# EAGLE design schematic (EAGLE 8.0.2)
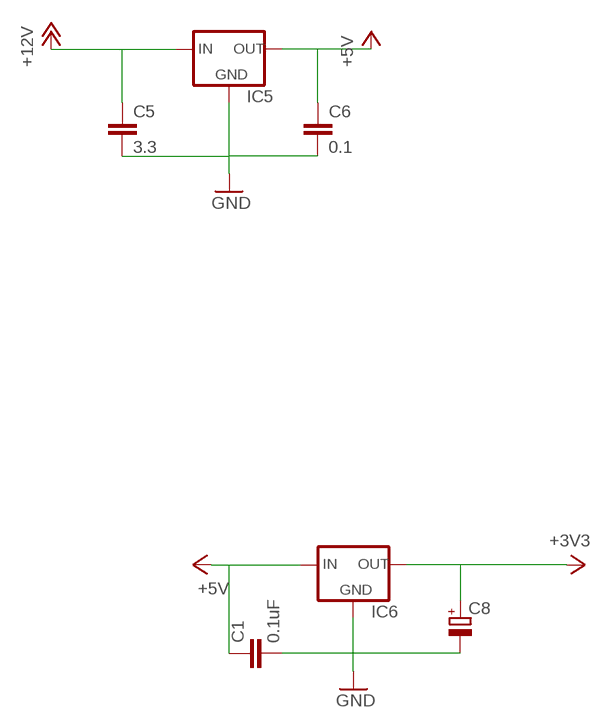
[diagram p0: schematic, sheet 1, part 1 of 2]
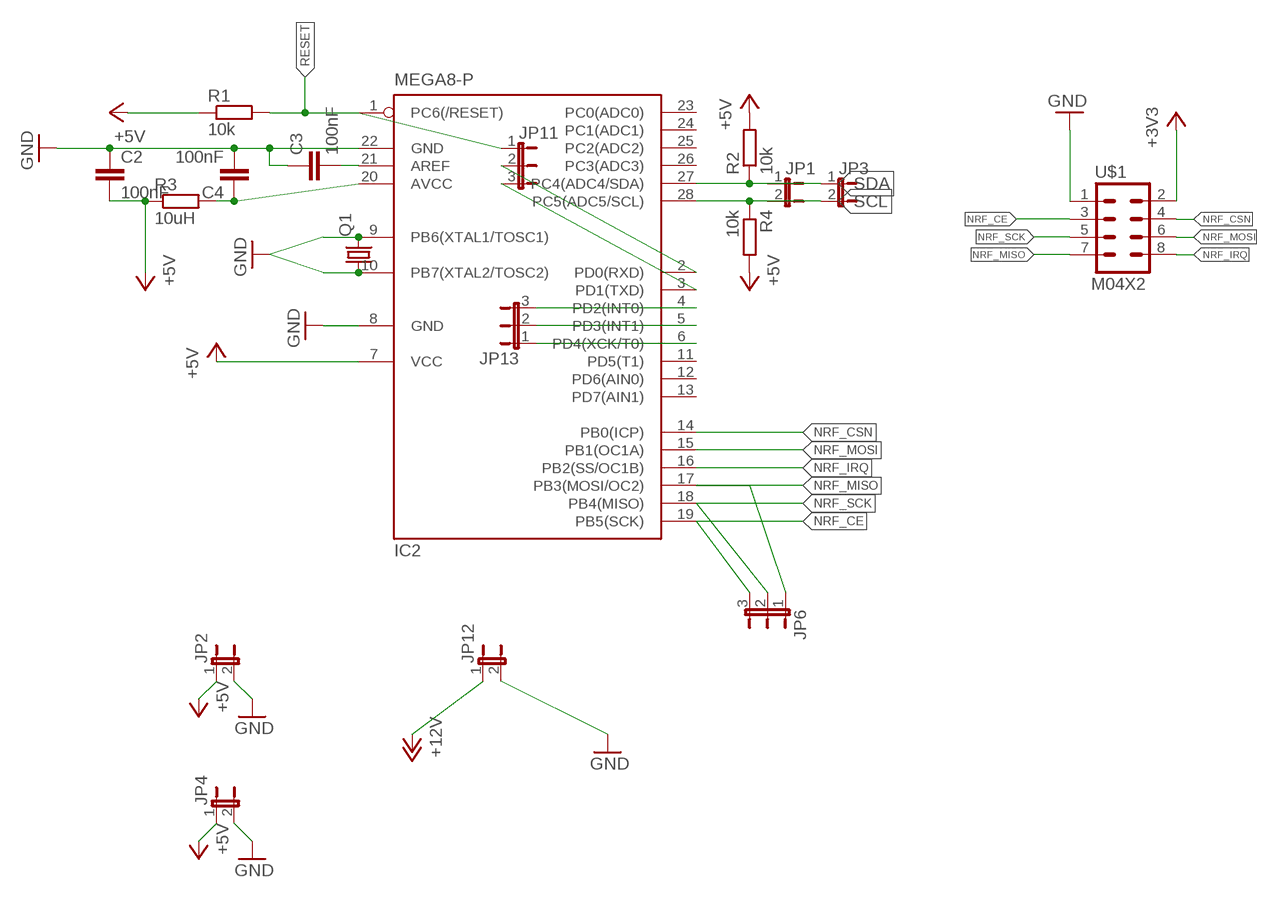
[diagram p1: schematic, sheet 1, part 2 of 2]

## Parts
C1  0.1uF  C2.5/2  [C2.5-2]
C2  100nF  C2.5/2  [C2.5-2]
C3  100nF  C2.5/4  [C2.5-4]
C4  100nF  C5/2.5  [C5B2.5]
C5  3.3  C-EU025-024X044  [C025-024X044]
C6  0.1  C-EU025-024X044  [C025-024X044]
C8  CPOL-EUE2.5-6  [E2,5-6]
IC2  MEGA8-P  [DIL28-3]
IC5  78XXL  [78XXL]
IC6  78XXL  [78XXL]
JP1  JP1E  [JP1]
JP2  JP1E  [JP1]
JP3  JP1E  [JP1]
JP4  JP1E  [JP1]
JP6  JP2E  [JP2]
JP11  JP2E  [JP2]
JP12  JP1E  [JP1]
JP13  JP2E  [JP2]
Q1  CRYSTALHC49S  [HC49/S]
R1  10k  R-EU_0204/5  [0204/5]
R2  10k  R-EU_0204/5  [0204/5]
R3  10uH  R-EU_0309/10  [0309/10]
R4  10k  R-EU_0204/5  [0204/5]
U$1  M04X2  [2X4]

## Nets
+3V3: C8.+ IC6.OUT U$1.2
+5V: C1.1 C2.2 C6.1 IC2.7(VCC) IC5.OUT IC6.IN JP2.1 JP4.1 R1.1 R2.2 R3.1 R4.2
+12V: C5.1 IC5.IN JP12.1
GND: C1.2 C2.1 C3.1 C4.2 C5.2 C6.2 C8.- IC2.8(GND) IC2.22(GND) IC5.GND IC6.GND JP2.2 JP4.2 JP12.2 U$1.1
N$2: C3.2 IC2.21(AREF)
N$5: IC2.9(PB6(XTAL1/TOSC1)) Q1.2
N$6: IC2.10(PB7(XTAL2/TOSC2)) Q1.1
N$9: C4.1 IC2.20(AVCC) R3.2
N$39: IC2.2(PD0(RXD)) JP11.2
N$40: IC2.3(PD1(TXD)) JP11.3
N$41: IC2.4(PD2(INT0)) JP13.3
N$42: IC2.5(PD3(INT1)) JP13.2
N$43: IC2.6(PD4(XCK/T0)) JP13.1
NRF_CE: IC2.19(PB5(SCK)) JP6.3 U$1.3
NRF_CSN: IC2.14(PB0(ICP)) U$1.4
NRF_IRQ: IC2.16(PB2(SS/OC1B)) U$1.8
NRF_MISO: IC2.17(PB3(MOSI/OC2)) JP6.1 U$1.7
NRF_MOSI: IC2.15(PB1(OC1A)) U$1.6
NRF_SCK: IC2.18(PB4(MISO)) JP6.2 U$1.5
RESET: IC2.1(PC6(/RESET)) JP11.1 R1.2
SCL: IC2.28(PC5(ADC5/SCL)) JP1.2 JP3.2 R4.1
SDA: IC2.27(PC4(ADC4/SDA)) JP1.1 JP3.1 R2.1
Unconnected: IC2.11(PD5(T1)) IC2.12(PD6(AIN0)) IC2.13(PD7(AIN1)) IC2.23(PC0(ADC0)) IC2.24(PC1(ADC1)) IC2.25(PC2(ADC2)) IC2.26(PC3(ADC3))

## Library data of the parts
C1-C4 = capacitor-wima:C: CAPACITOR naming: grid - package width
C5 C6 = rcl:C-EU: CAPACITOR, European symbol
C8 = resistor:CPOL-EU: POLARIZED CAPACITOR, European symbol
IC2 = atmel:MEGA8-P: MICROCONTROLLER 8 Kbytes FLASH, 1 kbytes SRAM, 512 bytes EEPROM, USART, 4-channel 10 bit ADC, 2-channel 8 bit ADC Pin compatible with Atmega48, ATMega88, ATMega168 Source: avr.lbr; OC_FARNELL: unknown; OC_NEWARK: unknown
IC5 IC6 = v-reg:78XXL: VOLTAGE REGULATOR
JP1-JP4 JP12 = jumper:JP1E: JUMPER
JP6 JP11 JP13 = jumper:JP2E: JUMPER
Q1 = crystal:CRYSTAL: CRYSTAL; OC_FARNELL: 1667008; OC_NEWARK: unknown
R1-R4 = resistor:R-EU_: RESISTOR, European symbol
U$1 = SparkFun:M04X2

## Net classes
0 default: clearance 0.205 mm

## Board
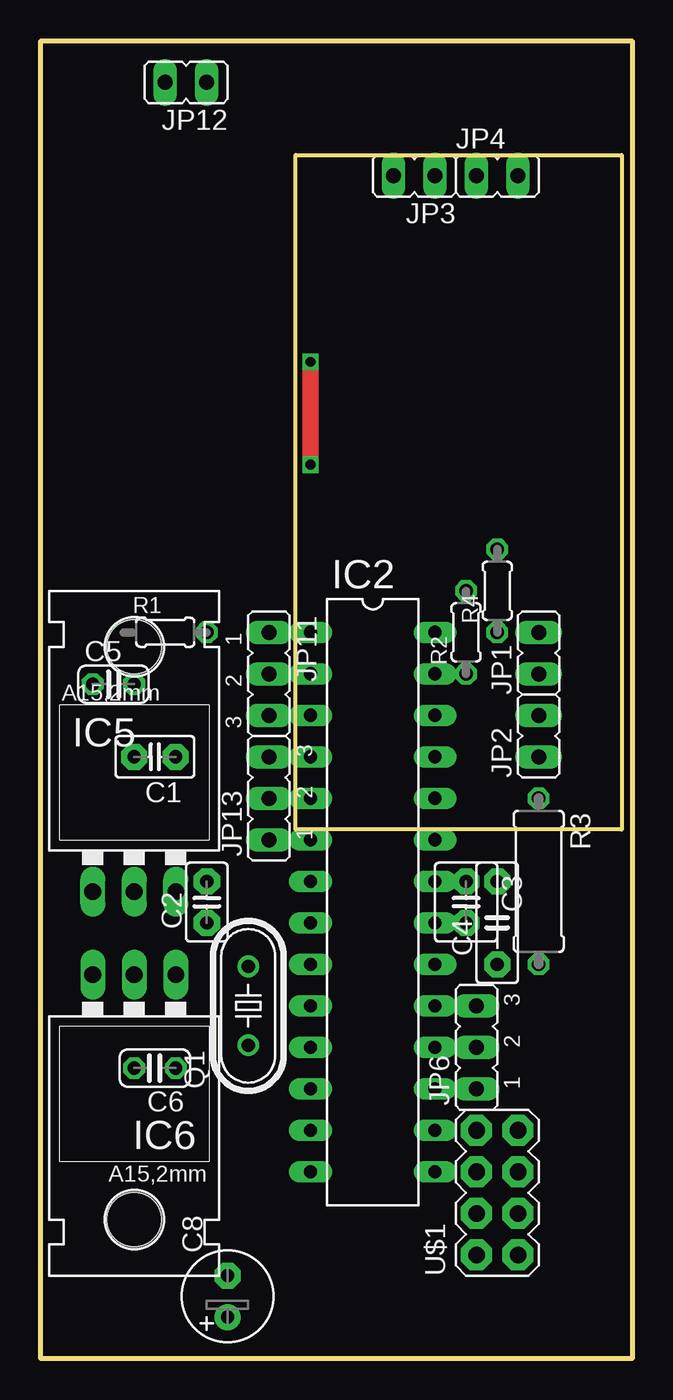
[diagram p2: board, top side]
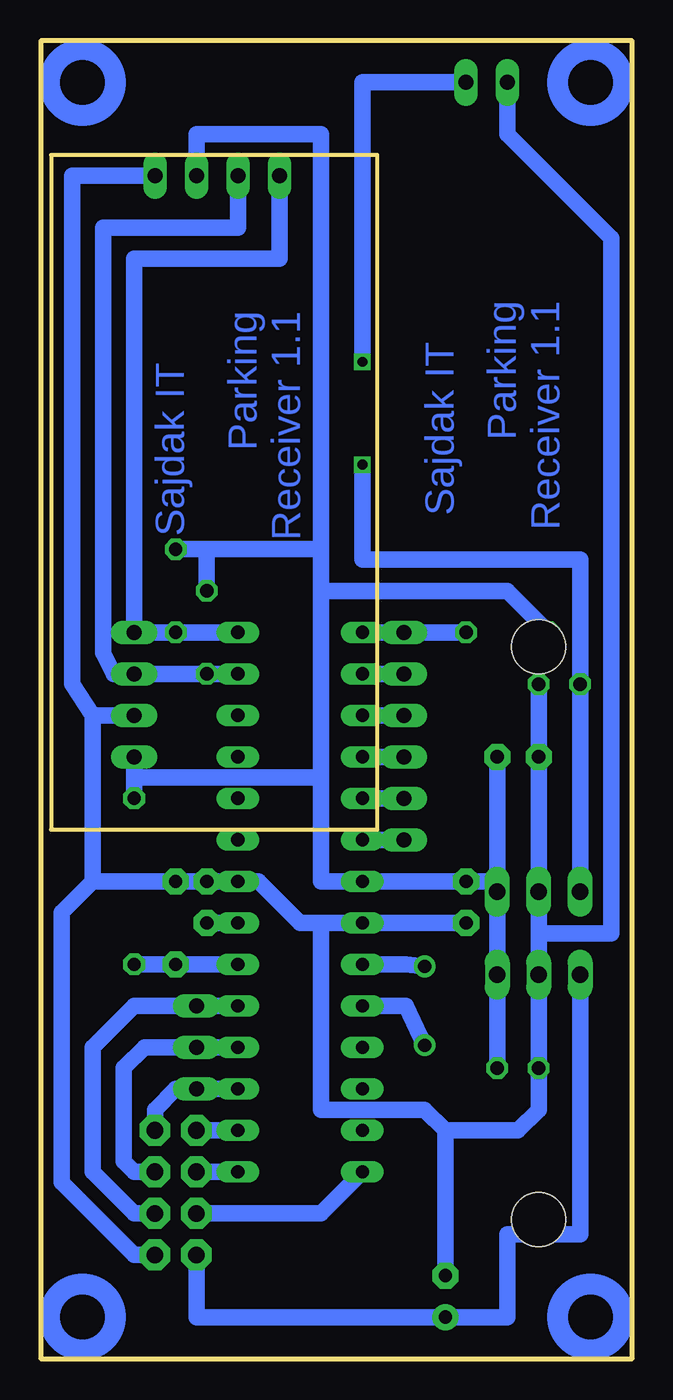
[diagram p3: board, bottom side, seen from below]

Size 36.2 x 80.64 mm. Coordinates in mm from the lower left corner, seen from the top.
Outline: 0,77.46 0,3.17
Outline: 0,80.64 36.2,80.64 36.2,0 0,0 0,80.64
Outline: 15.6,32.38 15.6,73.66 35.56,73.66 35.56,32.38 15.6,32.38
Copper layers (1*16): Top 0.035mm / dielectric 1.5mm / Bottom 0.035mm
Design rules "default": minimum track width 10mil, minimum drill 24mil, track to track 8mil, track to pad 8mil, pad to pad 8mil, via to via 8mil, smd to smd 8mil, copper to edge 40mil, drill to drill 8mil, minimum pad ring 10mil, minimum via ring 8mil, stop-mask expansion 4mil, vias tented up to drill 0mil, thermal gap 10mil

### Footprints (pad centres in the part's own frame; a part is rotated, then mirrored left to right if it is on the bottom)
C2.5-2 = drill 0.813 pad 1.6 octagon: 1 -1.27,0; 2 1.27,0
C2.5-4 = drill 0.813 pad 1.6 octagon: 1 -1.27,0; 2 1.27,0
C5B2.5 = drill 0.813 pad 1.6 octagon: 1 -2.54,0; 2 2.54,0
C025-024X044 = drill 0.813 octagon: 1 -1.27,0; 2 1.27,0
E2,5-6 = drill 0.813 pad 1.6: + -1.27,0 | drill 0.813 pad 1.6 octagon: - 1.27,0
DIL28-3 = drill 0.813 long: 1 -16.51,-3.81; 2 -13.97,-3.81; 3 -11.43,-3.81; 4 -8.89,-3.81; 5 -6.35,-3.81; 6 -3.81,-3.81; 7 -1.27,-3.81; 8 1.27,-3.81; 9 3.81,-3.81; 10 6.35,-3.81; 11 8.89,-3.81; 12 11.43,-3.81; 13 13.97,-3.81; 14 16.51,-3.81; 15 16.51,3.81; 16 13.97,3.81; 17 11.43,3.81; 18 8.89,3.81; 19 6.35,3.81; 20 3.81,3.81; 21 1.27,3.81; 22 -1.27,3.81; 23 -3.81,3.81; 24 -6.35,3.81; 25 -8.89,3.81; 26 -11.43,3.81; 27 -13.97,3.81; 28 -16.51,3.81
78XXL = drill 1.016 long: GND 0,-3.81; IN -2.54,-3.81; OUT 2.54,-3.81 | hole 3.302: 0,11.176
JP1 = drill 0.914 long: 1 0,-1.27; 2 0,1.27
JP2 = drill 0.914 long: 1 -2.54,0; 2 0,0; 3 2.54,0
HC49/S = drill 0.813: 1 -2.413,0; 2 2.413,0
0204/5 = drill 0.813 octagon: 1 -2.54,0; 2 2.54,0
0309/10 = drill 0.813 octagon: 1 -5.08,0; 2 5.08,0
2X4 = drill 1.016 pad 1.88 octagon: 1 -3.81,-1.27; 2 -3.81,1.27; 3 -1.27,-1.27; 4 -1.27,1.27; 5 1.27,-1.27; 6 1.27,1.27; 7 3.81,-1.27; 8 3.81,1.27

### Placement (x,y rotation side)
C1  6.99,36.83 180 top
C2  10.16,27.94 90 top
C3  26.04,27.94 270 top
C4  27.94,26.67 90 top
C5  4.45,41.27 0 top
C6  6.99,17.78 180 top
C8  11.43,3.81 90 top
IC2  20.32,27.94 270 top
IC5  5.71,32.38 0 top
IC6  5.71,19.68 180 top
JP1  30.48,43.18 0 top
JP2  30.48,38.1 0 top
JP3  22.86,72.39 90 top
JP4  27.94,72.39 270 top
JP6  26.67,19.05 90 top
JP11  13.97,41.91 270 top
JP12  8.89,78.11 90 top
JP13  13.97,34.29 90 top
Q1  12.7,21.59 90 top
R1  7.62,44.45 0 top
R2  26.04,44.45 90 top
R3  30.48,29.21 270 top
R4  27.94,46.99 90 top
U$1  27.94,10.16 90 top

### Tracks (layer width: path | path; a pad name or v marks a point on that pad's centre or on a via)
+3V3
  Bottom 1.016: U$1.2 26.67,2.54 C8.+ 7.62,2.54 7.62,7.62 3.17,7.62 IC6.OUT
+5V
  Bottom 1.016: 19.05,46.99 19.05,35.56 | 19.05,46.99 19.05,49.53 | 19.05,35.56 19.05,29.21 IC2.7 C2.2 8.26,29.21 | 8.26,29.21 IC5.OUT IC6.IN C6.1 | 8.26,29.21 C1.1 | 30.48,35.56 R3.1 | 30.48,35.56 19.05,35.56 | JP2.1 30.48,35.56 | JP4.1 26.67,74.93 19.05,74.93 19.05,49.53 | 26.04,49.53 19.05,49.53 | 26.04,49.53 R4.2 | R2.2 26.04,49.53 | R1.1 7.62,46.99 19.05,46.99
+12V  (via drill 0.6)
  Top 1.016: v16.51,61 v16.51,54.7
  Bottom 1.016: IC5.IN C5.1 3.17,48.9 16.51,48.9 v16.51,54.7 | JP12.1 16.51,78.11 v16.51,61
GND
  Bottom 1.016: C5.2 C1.2 IC5.GND 5.71,26.04 | 19.05,26.67 20.32,26.67 22.86,29.21 IC2.22 C3.1 C4.2 33.02,29.21 | 19.05,26.67 IC2.8 C2.1 | 19.05,26.67 19.05,15.24 12.7,15.24 11.43,13.97 | JP2.2 33.02,39.37 | 33.02,29.21 33.02,39.37 | U$1.1 30.48,6.35 34.92,10.79 34.92,27.3 33.02,29.21 | 33.02,39.37 34.29,41.27 34.29,72.39 JP4.2 | 5.71,26.04 IC6.GND C6.2 5.71,15.24 6.99,13.97 11.43,13.97 | 5.71,26.04 1.27,26.04 1.27,68.58 7.62,74.93 JP12.2 | 11.43,13.97 C8.-
N$2
  Bottom 1.016: IC2.21 C3.2
N$5
  Bottom 1.016: IC2.9 13.84,24.13 Q1.2
N$6
  Bottom 1.016: IC2.10 13.84,21.59 Q1.1
N$9
  Bottom 1.016: IC2.20 C4.1 R3.2
N$39
  Bottom 1.016: JP11.2 IC2.2
N$40
  Bottom 1.016: JP11.3 IC2.3
N$41
  Bottom 1.016: IC2.4 JP13.3
N$42
  Bottom 1.016: JP13.2 IC2.5
N$43
  Bottom 1.016: IC2.6 JP13.1
NRF_CE
  Bottom 1.016: IC2.19 JP6.3 30.48,21.59 33.02,19.05 33.02,11.43 30.48,8.89 U$1.3
NRF_CSN
  Bottom 1.016: U$1.4 19.05,8.89 IC2.14
NRF_IRQ
  Bottom 1.016: IC2.16 U$1.8
NRF_MISO
  Bottom 1.016: IC2.17 JP6.1 27.94,16.51 29.21,15.24 U$1.7
NRF_MOSI
  Bottom 1.016: IC2.15 U$1.6
NRF_SCK
  Bottom 1.016: IC2.18 JP6.2 29.84,19.05 31.11,17.78 31.11,12.06 30.48,11.43 U$1.5
RESET
  Bottom 1.016: IC2.1 JP11.1 R1.2
SCL
  Bottom 1.016: IC2.28 JP1.2 | R4.1 JP1.2 | JP1.2 30.48,67.31 21.59,67.31 JP3.2
SDA
  Bottom 1.016: IC2.27 R2.1 JP1.1 31.75,41.91 32.38,43.18 32.38,69.22 24.13,69.22 JP3.1
(copper drawn outside any net)
  shapes: Bottom circle x4

### Text on the board
Bottom: Parking / Receiver 1.1 | Parking / Receiver 1.1 | Sajdak IT | Sajdak IT